# Altium schematic sheet LPCB218 - CORE INTERFACE.SchDoc
size A3; Address1: Factory 10; Address2: 9-13 Dingley Avenue, Dandeong, VICTORIA 3175, AUSTRALIA; DocumentNumber: 3; Revision: 1; SheetNumber: 3; SheetTotal: 14; Lockie__PCB_SUB_ASSEMBLY: Core Interface; Lockie__PCB_ASSEMBLY: Command Node; Lockie__LDL: LPCB218; Lockie__PCB_DESCRIPTION: Command Node
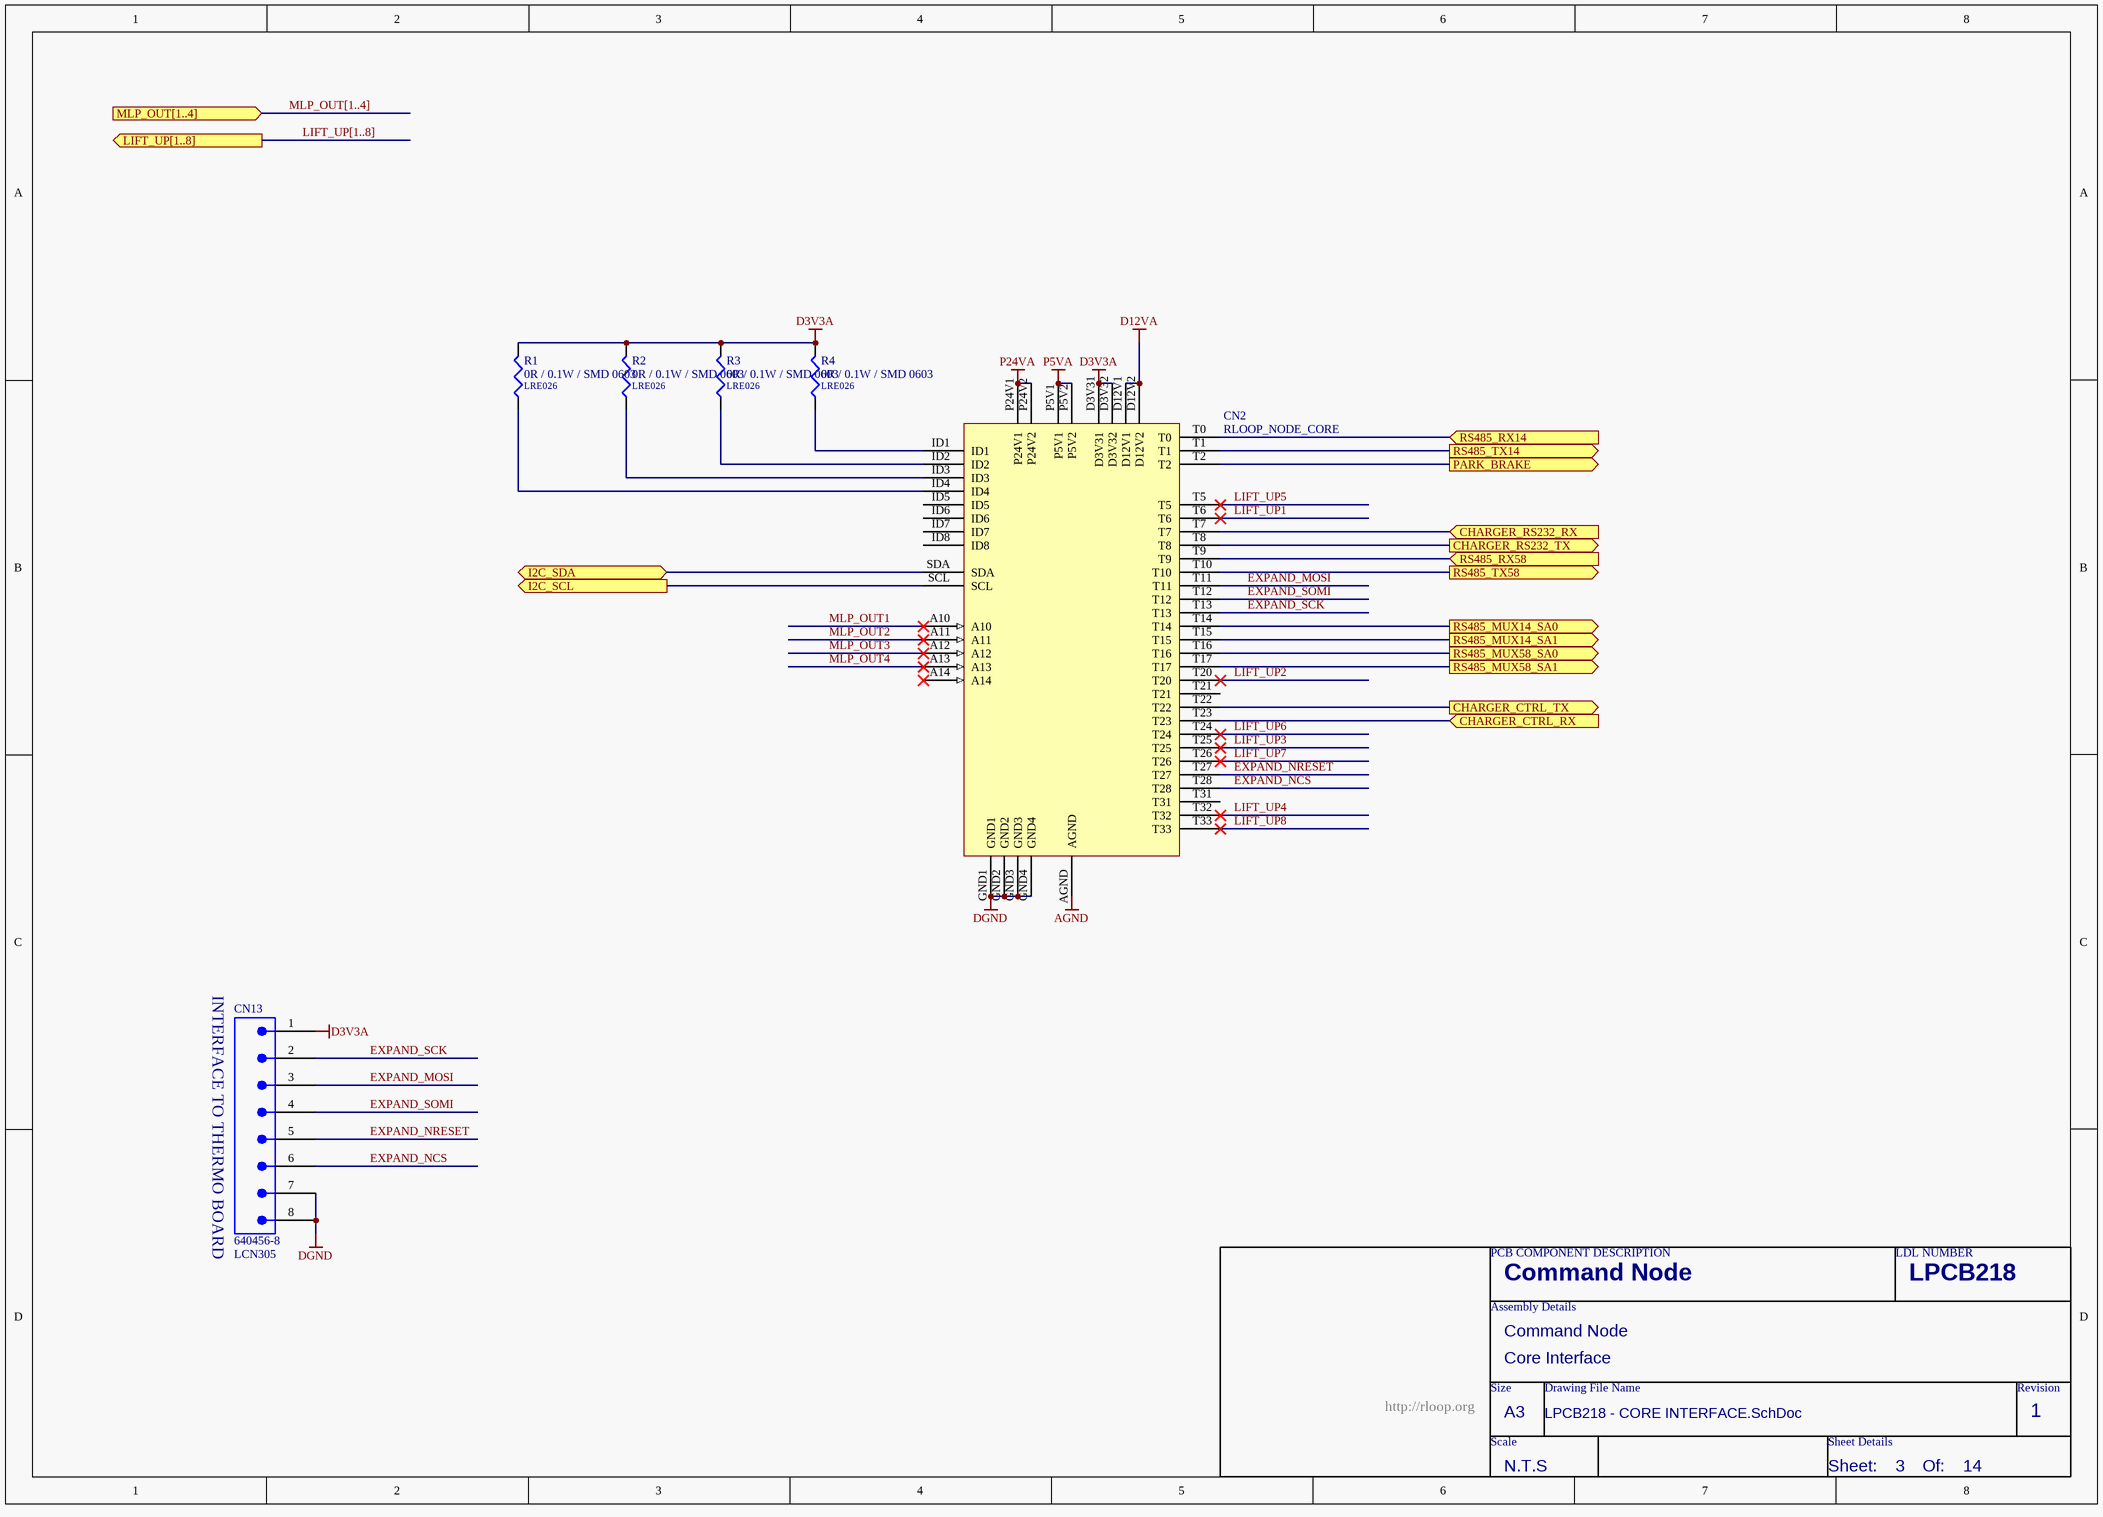
[diagram p0: LPCB218 - CORE INTERFACE.SchDoc]

## Parts
CN2  RLOOP_NODE_CORE  [RLOOP_NODE_CORE]  (no BOM)
CN13  640456-8  LDL_NUMBER: LCN305  [640456-8]
R1  0R / 0.1W / SMD 0603  LDL_NUMBER: LRE026  [LFP020__CR1608-0603-IPC7351_B]
R2  0R / 0.1W / SMD 0603  LDL_NUMBER: LRE026  [LFP020__CR1608-0603-IPC7351_B]
R3  0R / 0.1W / SMD 0603  LDL_NUMBER: LRE026  [LFP020__CR1608-0603-IPC7351_B]
R4  0R / 0.1W / SMD 0603  LDL_NUMBER: LRE026  [LFP020__CR1608-0603-IPC7351_B]

## Ports
CHARGER_CTRL_RX (in), CHARGER_CTRL_TX (out), CHARGER_RS232_RX (in), CHARGER_RS232_TX (out), I2C_SCL (out), I2C_SDA (bidir), LIFT_UP[1..8] (out), MLP_OUT[1..4] (in), PARK_BRAKE (out), RS485_MUX14_SA0 (out), RS485_MUX14_SA1 (out), RS485_MUX58_SA0 (out), RS485_MUX58_SA1 (out), RS485_RX14 (in), RS485_RX58 (in), RS485_TX14 (out), RS485_TX58 (out)

## Nets
AGND: CN2.AGND
D3V3A: CN2.D3V31 CN2.D3V32 CN13.1 R1.2 R2.2 R3.2 R4.2
D12VA: CN2.D12V1 CN2.D12V2
DGND: CN2.GND1 CN2.GND2 CN2.GND3 CN2.GND4 CN13.7 CN13.8
P5VA: CN2.P5V1 CN2.P5V2
P24VA: CN2.P24V1 CN2.P24V2
CHARGER_CTRL_RX: CN2.T23 ; port CHARGER_CTRL_RX
CHARGER_CTRL_TX: CN2.T22 ; port CHARGER_CTRL_TX
CHARGER_RS232_RX: CN2.T7 ; port CHARGER_RS232_RX
CHARGER_RS232_TX: CN2.T8 ; port CHARGER_RS232_TX
EXPAND_MOSI: CN2.T11 CN13.3
EXPAND_NCS: CN2.T28 CN13.6
EXPAND_NRESET: CN2.T27 CN13.5
EXPAND_SCK: CN2.T13 CN13.2
EXPAND_SOMI: CN2.T12 CN13.4
I2C_SCL: CN2.SCL ; port I2C_SCL
I2C_SDA: CN2.SDA ; port I2C_SDA
LIFT_UP1: CN2.T6
LIFT_UP2: CN2.T20
LIFT_UP3: CN2.T25
LIFT_UP4: CN2.T32
LIFT_UP5: CN2.T5
LIFT_UP6: CN2.T24
LIFT_UP7: CN2.T26
LIFT_UP8: CN2.T33
MLP_OUT1: CN2.A10
MLP_OUT2: CN2.A11
MLP_OUT3: CN2.A12
MLP_OUT4: CN2.A13
PARK_BRAKE: CN2.T2 ; port PARK_BRAKE
RS485_MUX14_SA0: CN2.T14 ; port RS485_MUX14_SA0
RS485_MUX14_SA1: CN2.T15 ; port RS485_MUX14_SA1
RS485_MUX58_SA0: CN2.T16 ; port RS485_MUX58_SA0
RS485_MUX58_SA1: CN2.T17 ; port RS485_MUX58_SA1
RS485_RX14: CN2.T0 ; port RS485_RX14
RS485_RX58: CN2.T9 ; port RS485_RX58
RS485_TX14: CN2.T1 ; port RS485_TX14
RS485_TX58: CN2.T10 ; port RS485_TX58
NetCN2_ID1: CN2.ID1 R4.1
NetCN2_ID2: CN2.ID2 R3.1
NetCN2_ID3: CN2.ID3 R2.1
NetCN2_ID4: CN2.ID4 R1.1

Not connected (* = marked no-connect by the designer): CN2 A14* ID5 ID6 ID7 ID8 T21 T31

## Buses and harness runs
bus LIFT_UP[1..8] = port LIFT_UP[1..8]
bus MLP_OUT[1..4] = port MLP_OUT[1..4]

## Notes on the sheet
- (near CN13) INTERFACE TO THERMO BOARD
- PCB COMPONENT DESCRIPTION
- LDL NUMBER
- Assembly Details
- Size
- Drawing File Name
- Revision
- http://rloop.org
- Scale
- A3
- Sheet Details
- N.T.S
- Sheet:
- Of:

## Library data of the parts
CN2 = RLOOP_NODE_CORE: rLoop Node Core Connector; FMEDA__CHANNEL: COM; FMEDA__OPERATING__CURRENT_MAX: 0; FMEDA__OPERATING__TEMP_MAX: 50; FMEDA__OPERATING__TEMP_MIN: -20; FMEDA__OPERATING__TEMP_TYP: 27; FMEDA__OPERATING__VOLTAGE_MAX: 16; FMEDA__OPERATING__VOLTAGE_TYP: 12; FMEDA__OPERATING__CURRENT_MIN: 0; FMEDA__OPERATING__CURRENT_TYP: 0; FMEDA__OPERATING__VOLTAGE_MIN: 0
CN13 = 640456-8: Connector, Male Header, 8 Way; FMEDA__CHANNEL: COM; FMEDA__OPERATING__CURRENT_MAX: 0; FMEDA__OPERATING__TEMP_MAX: 50; FMEDA__OPERATING__TEMP_MIN: -20; FMEDA__OPERATING__TEMP_TYP: 27; FMEDA__OPERATING__VOLTAGE_MAX: 16; FMEDA__OPERATING__VOLTAGE_TYP: 12; FMEDA__FUNCTION_IN_SYSTEM: *; FMEDA__OPERATING__CURRENT_MIN: 0; FMEDA__OPERATING__CURRENT_TYP: 0; FMEDA__OPERATING__VOLTAGE_MIN: 0
R1-R4 = 0R / 0.1W / SMD 0603: Resistor, Ceramic Chip, 0R, 0.1W, SMD 0603 [LRE026]; Value: 0; FMEDA__OPERATING__TEMP_MAX: 50; FMEDA__OPERATING__TEMP_MIN: -20; FMEDA__OPERATING__TEMP_TYP: 27; FMEDA__CHANNEL: COM; FMEDA__OPERATING__POWER_MAX: 0; FMEDA__OPERATING__POWER_MIN: 0; FMEDA__OPERATING__VOLTAGE_MAX: 0; FMEDA__OPERATING__VOLTAGE_MIN: 0; FMEDA__OPERATING__VOLTAGE_TYP: 0; FMEDA__FUNCTION_IN_SYSTEM: *